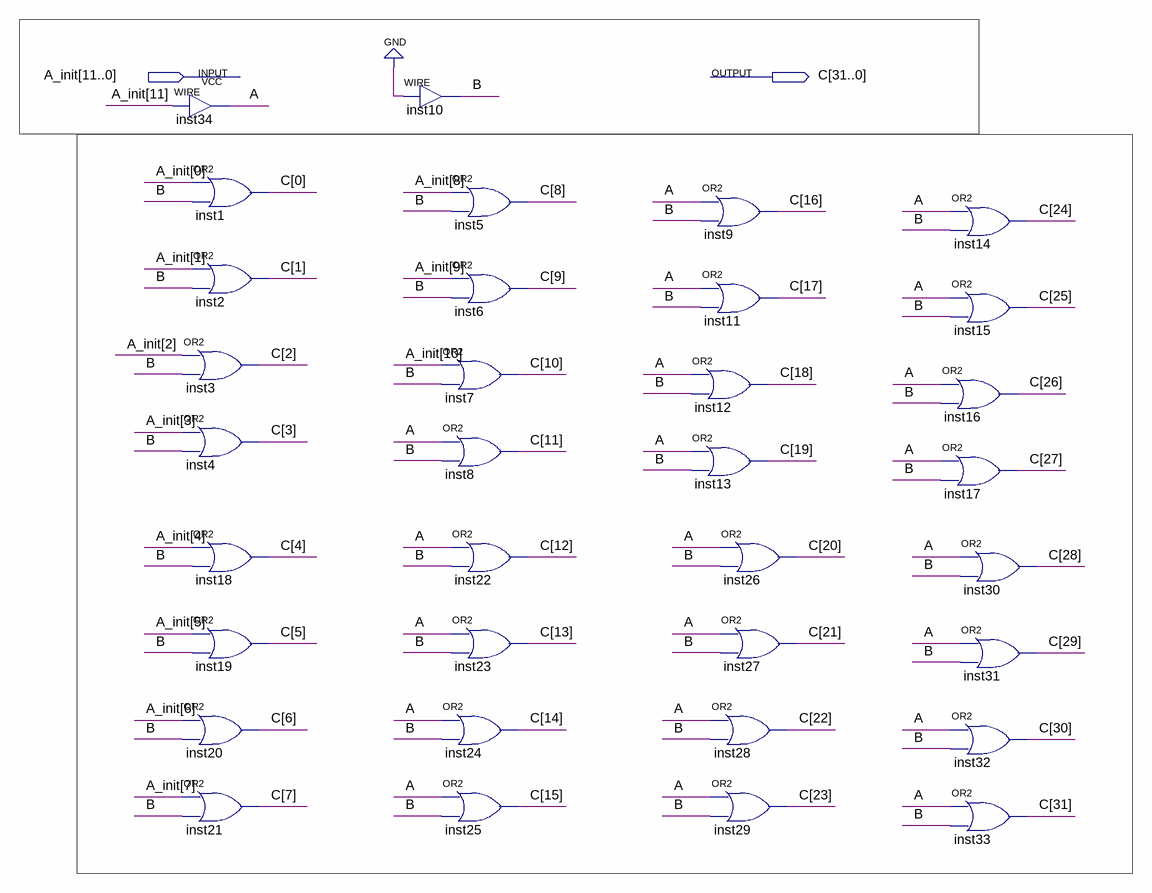
[diagram p0: schematic sheet]
// Quartus schematic or_group_ExtU.bdf as structural Verilog: 34 symbols, 2 pins
module or_group_ExtU (
  input  [11:0] A_init,
  output [31:0] C
);

  wire A, B;

  assign A = A_init[11];  // WIRE inst34
  or inst1 (C[0], A_init[0], B);
  or inst2 (C[1], A_init[1], B);
  or inst3 (C[2], A_init[2], B);
  or inst4 (C[3], A_init[3], B);
  or inst18 (C[4], A_init[4], B);
  or inst19 (C[5], A_init[5], B);
  or inst20 (C[6], A_init[6], B);
  or inst21 (C[7], A_init[7], B);
  assign B = 1'b0;  // WIRE inst10
  or inst7 (C[10], A_init[10], B);
  or inst8 (C[11], A, B);
  or inst24 (C[14], A, B);
  or inst25 (C[15], A, B);
  or inst5 (C[8], A_init[8], B);
  or inst6 (C[9], A_init[9], B);
  or inst22 (C[12], A, B);
  or inst23 (C[13], A, B);
  or inst9 (C[16], A, B);
  or inst11 (C[17], A, B);
  or inst12 (C[18], A, B);
  or inst13 (C[19], A, B);
  or inst26 (C[20], A, B);
  or inst27 (C[21], A, B);
  or inst28 (C[22], A, B);
  or inst29 (C[23], A, B);
  or inst14 (C[24], A, B);
  or inst15 (C[25], A, B);
  or inst16 (C[26], A, B);
  or inst17 (C[27], A, B);
  or inst30 (C[28], A, B);
  or inst31 (C[29], A, B);
  or inst32 (C[30], A, B);
  or inst33 (C[31], A, B);
endmodule
